# Altium schematic sheet MOTOR_DRIVER.SchDoc
size A4; SheetNumber: 3; SheetTotal: 4
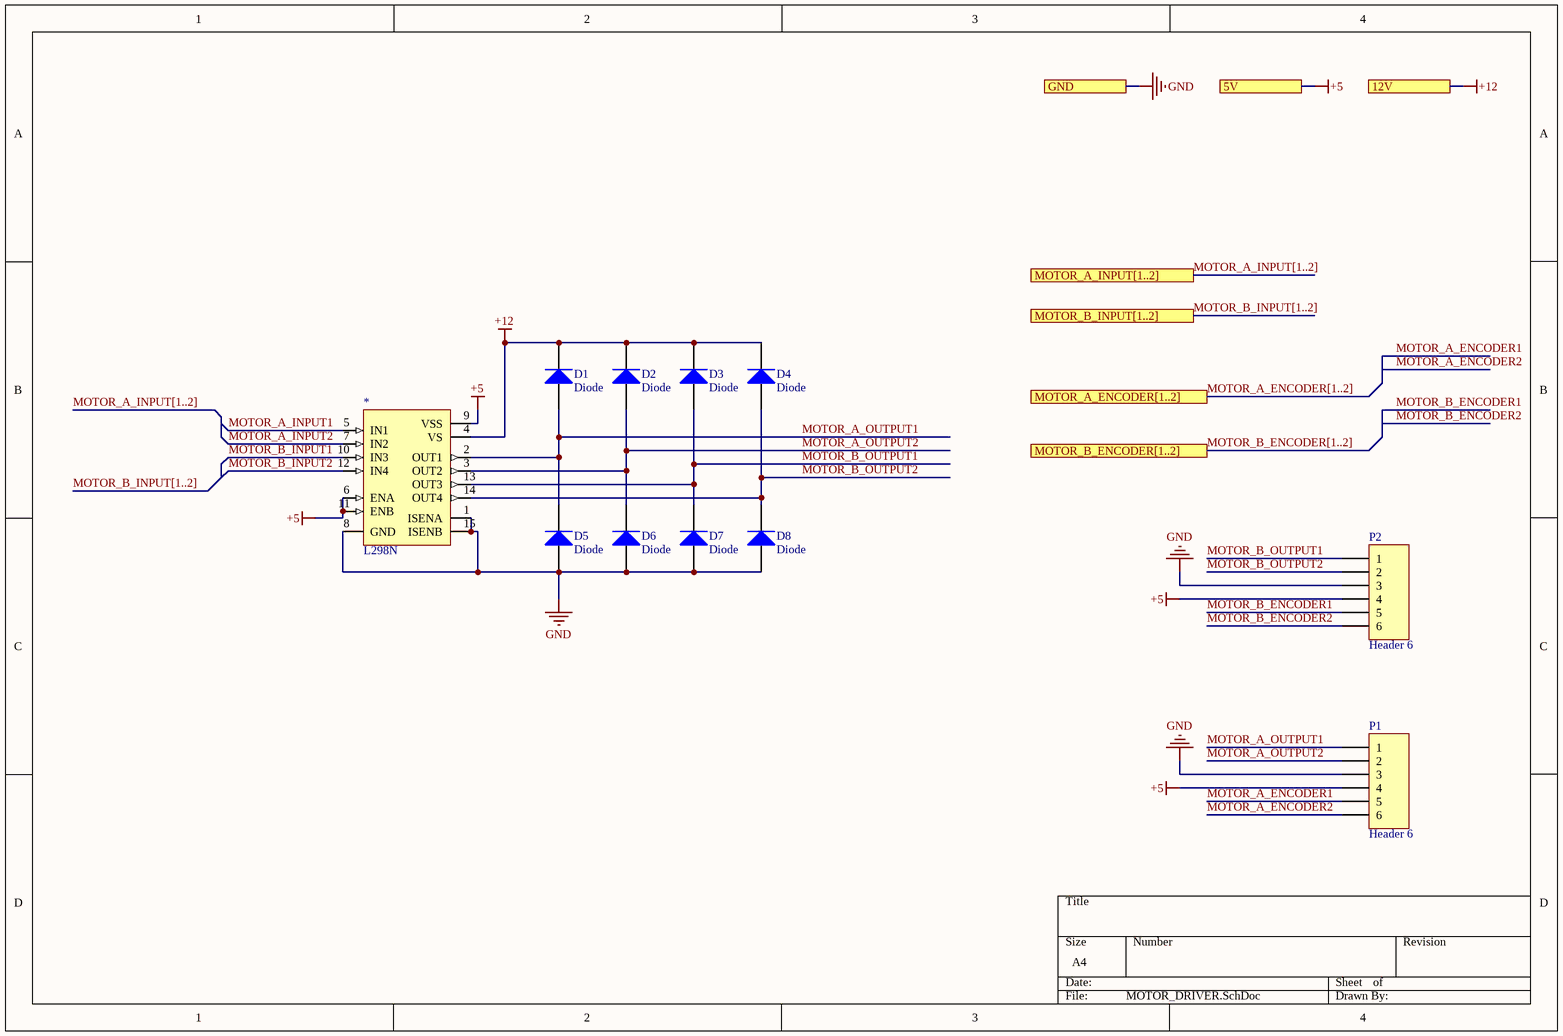
[diagram p0: MOTOR_DRIVER.SchDoc]

## Parts
*  L298N  [L298N-DIP]
D1  Diode  [MY0805]
D2  Diode  [MY0805]
D3  Diode  [MY0805]
D4  Diode  [MY0805]
D5  Diode  [MY0805]
D6  Diode  [MY0805]
D7  Diode  [MY0805]
D8  Diode  [MY0805]
P1  Header 6  [HDR1X6]
P2  Header 6  [HDR1X6]

## Ports
5V, 12V, GND, MOTOR_A_ENCODER[1..2], MOTOR_A_INPUT[1..2], MOTOR_B_ENCODER[1..2], MOTOR_B_INPUT[1..2]

## Nets
+5: *.6(ENA) *.9(VSS) *.11(ENB) P1.4 P2.4 ; port 5V
+12: *.4(VS) D1.2(K) D2.2(K) D3.2(K) D4.2(K) ; port 12V
GND: *.1(ISENA) *.8(GND) *.15(ISENB) D5.1(A) D6.1(A) D7.1(A) D8.1(A) P1.3 P2.3 ; port GND
MOTOR_A_ENCODER1: P1.5
MOTOR_A_ENCODER2: P1.6
MOTOR_A_INPUT1: *.5(IN1)
MOTOR_A_INPUT2: *.7(IN2)
MOTOR_A_OUTPUT1: *.2(OUT1) D1.1(A) D5.2(K) P1.1
MOTOR_A_OUTPUT2: *.3(OUT2) D2.1(A) D6.2(K) P1.2
MOTOR_B_ENCODER1: P2.5
MOTOR_B_ENCODER2: P2.6
MOTOR_B_INPUT1: *.10(IN3)
MOTOR_B_INPUT2: *.12(IN4)
MOTOR_B_OUTPUT1: *.13(OUT3) D3.1(A) D7.2(K) P2.1
MOTOR_B_OUTPUT2: *.14(OUT4) D4.1(A) D8.2(K) P2.2

## Buses and harness runs
bus MOTOR_A_ENCODER[1..2] = port MOTOR_A_ENCODER[1..2]
bus MOTOR_A_INPUT[1..2]
bus MOTOR_A_INPUT[1..2] = port MOTOR_A_INPUT[1..2]
bus MOTOR_B_ENCODER[1..2] = port MOTOR_B_ENCODER[1..2]
bus MOTOR_B_INPUT[1..2]
bus MOTOR_B_INPUT[1..2] = port MOTOR_B_INPUT[1..2]

## Library data of the parts
D1-D8 = Diode: Default Diode; Published: 8-Jun-2000; LatestRevisionDate: 17-Jul-2002; LatestRevisionNote: Re-released for DXP Platform.; PackageVersion: Sep-1996; PackageReference: SMC; Publisher: Altium Limited; PackageDescription: DO-214-AB/SMC; 2 C-Bend Leads; Body 7.9 x 5.9 mm, inc. leads (LxW); Code_JEDEC: DO-214-AB
P1 P2 = Header 6: Header, 6-Pin; LatestRevisionDate: 17-Jul-2002; LatestRevisionNote: Re-released for DXP Platform.; Publisher: Altium Limited